# Altium schematic sheet RS485.SchDoc
size A3; DocumentNumber: 1; SheetNumber: 5; SheetTotal: 5; ModifiedBy: -; RevisionDate: -; Size: A3
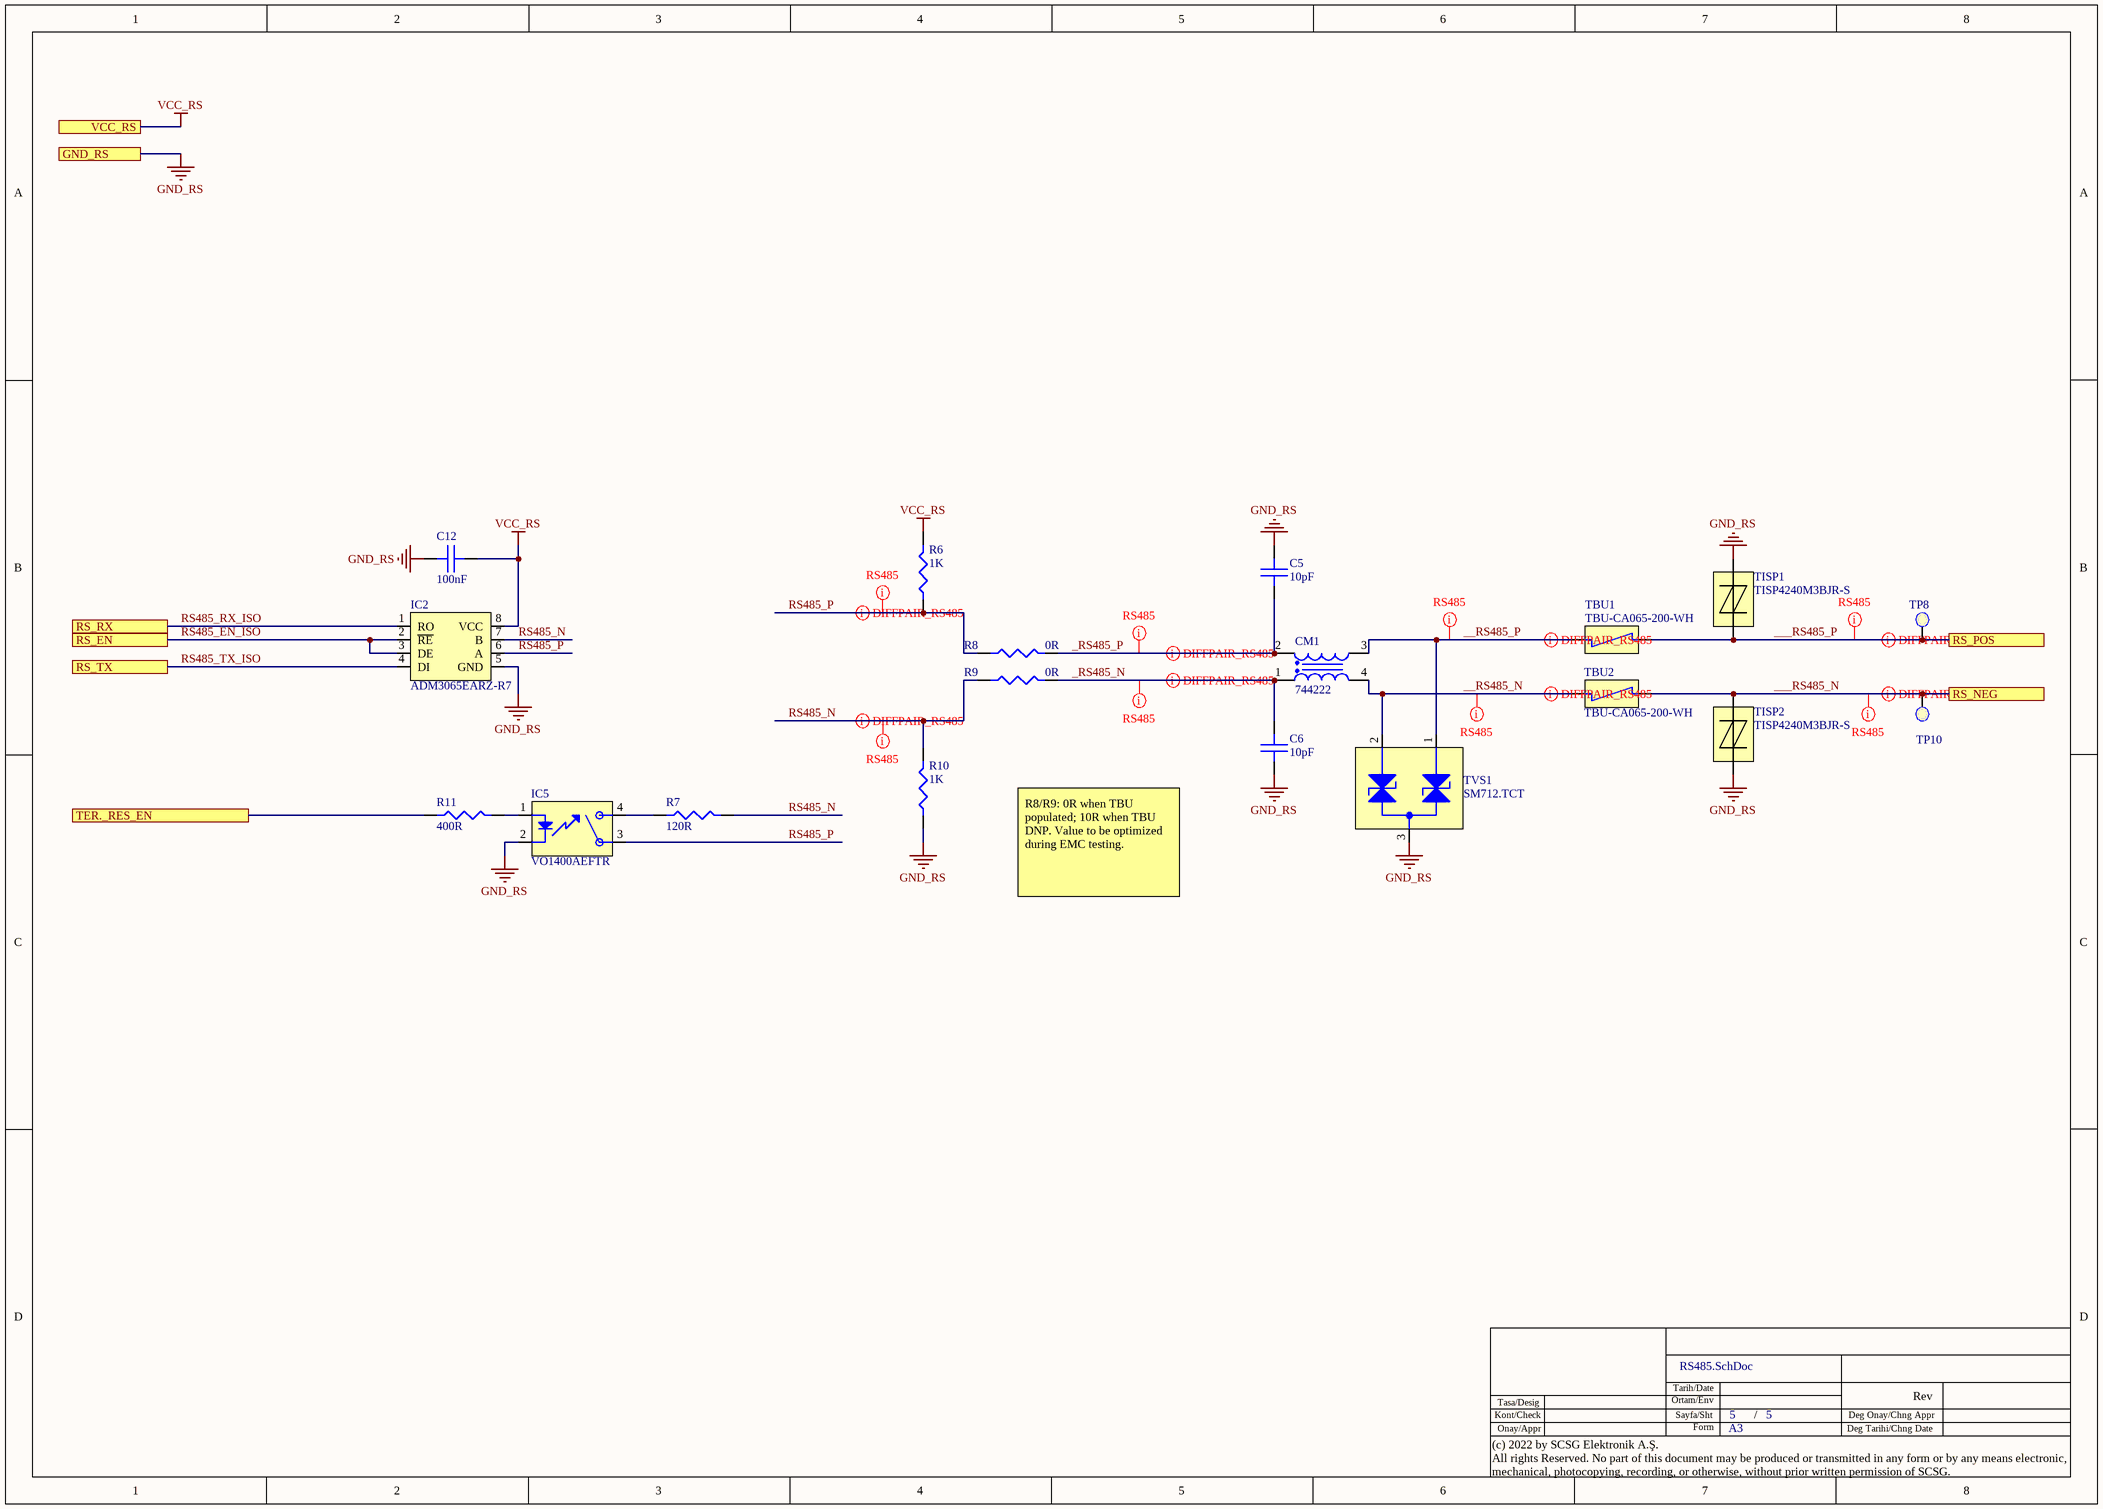
[diagram p0: RS485.SchDoc]

## Parts
C5  10pF  [C0402]
C6  10pF  [C0402]
C12  100nF  [C0603]
CM1  744222  [WE-SL2_74422]
IC2  ADM3065EARZ-R7  [SO08]
IC5  VO1400AEFTR  [SOP-4]
R6  1K  [R0805]
R7  120R  [R0805]
R8  0R  [R0603]
R9  0R  [R0603]
R10  1K  [R0805]
R11  400R  [R0603]
TBU1  TBU-CA065-200-WH  [TBU-CA065-200-WH]
TBU2  TBU-CA065-200-WH  [TBU-CA065-200-WH]
TISP1  TISP4240M3BJR-S  [SMB/DO-214AA]
TISP2  TISP4240M3BJR-S  [SMB/DO-214AA]
TP8  TestPoint1  [SMD_1mmPoint]  (value not drawn)  (no BOM)
TP10  TestPoint1  [SMD_1mmPoint]  (value not drawn)  (no BOM)
TVS1  SM712.TCT  [WE-TVS_SOT23-3L]

## Ports
GND_RS, RS_EN, RS_NEG, RS_POS, RS_RX, RS_TX, TER._RES_EN, VCC_RS

## Nets
GND_RS: C5.2 C6.1 C12.2 IC2.5(GND) IC5.2 R10.1 TISP1.1 TISP2.1 TVS1.3(GND) ; port GND_RS
VCC_RS: C12.1 IC2.8(VCC) R6.2 ; port VCC_RS
___RS485_N: TBU2.2 TISP2.2 TP10.1 ; port RS_NEG
___RS485_P: TBU1.2 TISP1.2 TP8.1 ; port RS_POS
__RS485_N: CM1.4 TBU2.1 TVS1.2(I/O_2)
__RS485_P: CM1.3 TBU1.1 TVS1.1(I/O_1)
_RS485_N: C6.2 CM1.1 R9.2
_RS485_P: C5.1 CM1.2 R8.2
RS485_EN_ISO: IC2.2(~{RE}) IC2.3(DE) ; port RS_EN
RS485_N: IC2.7(B) R7.2 R9.1 R10.2
RS485_P: IC2.6(A) IC5.3 R6.1 R8.1
RS485_RX_ISO: IC2.1(RO) ; port RS_RX
RS485_TX_ISO: IC2.4(DI) ; port RS_TX
TER._RES_EN: R11.1 ; port TER._RES_EN
NetIC5_1: IC5.1 R11.2
NetIC5_4: IC5.4 R7.1

## Layout directives
net class RS485: ___RS485_N, ___RS485_P, __RS485_N, __RS485_P, _RS485_N, _RS485_P, RS485_N, RS485_P
differential pair: ___RS485_N, ___RS485_P, __RS485_N, __RS485_P, _RS485_N, _RS485_P, RS485_N, RS485_P

## Notes on the sheet
- R8/R9: 0R when TBU populated; 10R when TBU DNP. Value to be optimized during EMC testing.
- Tarih/Date
- Kont/Check
- Tasa/Desig
- Onay/Appr
- Ortam/Env
- Sayfa/Sht
- Form
- A3
- /
- Deg Tarihi/Chng Date
- Deg Onay/Chng Appr
- Rev
- (c) 2022 by SCSG Elektronik A.Ş.
  All rights Reserved. No part of this document may be produced or transmitted in any form or by any means electronic, mechanical, photocopying, recording, or otherwise, without prior written permission of SCSG.

## Library data of the parts
C5 C6 = CC0402JRNPO9BN100: 10pF, 50V, NP0, 0402; Manufacturer: Yageo; Dielectric Material: Ceramic; Value: 10; Tolerance: 5%; Dielectric: C0G; Temperature Coefficient: 30ppm/°C; Purpose Of Usage: RS485; Working Voltage: 0; Supplier 1: Digi-Key; Manufacturer Part Number: CC0402JRNPO9BN100; RoHS: YES; Category: CAPASITOR; Case/Package: 0402; Case Code (Metric): 1005; Case Code (Imperial): 0402; Min Operating Temperature: -55°C; Max Operating Temperature: 125°C; Voltage Rating: 50V; Voltage Rating (DC): 50V; Height: 0.5mm; Supplier Part Number 1: 311-1014-2-ND; Mount: SMD; Stock ID: ??; Sub-Category: CERAMIC; Local Supplier: GENERAL; Price 10K: 0.00250
C12 = CC0603KRX7R8BB104: 100nF, 25V, X7R, 0603; Manufacturer: Yageo; Value: 100000; Tolerance: 10%; Dielectric Material: Ceramic; Purpose Of Usage: RS485; Working Voltage: 0; Supplier 1: Digi-Key; Supplier Part Number 1: 311-1341-1-ND; Manufacturer Part Number: CC0603KRX7R8BB104; RoHS: YES; Mount: SMD; Case/Package: 0603; Case Code (Imperial): 0603; Case Code (Metric): 1608; Min Operating Temperature: -55°C; Max Operating Temperature: 125°C; Voltage Rating: 25V; Voltage Rating (DC): 25V; Dielectric: X7R; Height: 0.8mm; Category: CAPASITOR; Sub-Category: CERAMIC; Stock ID: ??; Local Supplier: GENERAL; Price 10K: 0.00250
CM1 = 744222: Common Mode Chokes Dual 1000uH 6kOhm 100kHz 0.8A 0.207Ohm DCR SMD T/R Automotive AEC-Q200; Manufacturer: Wurth Elektronik; Current Rating: 800mA; DC Resistance (DCR): 310mΩ; Impedance: 6kΩ; Value: 1mH; Inductance Tolerance: 50%; Purpose Of Usage: RS485; Shielding: Shielded; Manufacturer Part Number: 744222; RoHS: YES; Category: INDUCTORS; Ambient Temperature Range High: 85°C; Ambient Temperature Range Low: -40°C; Case/Package: SMD/SMT; Height: 5mm; Length: 9.2mm; Max DC Current: 800mA; Max Operating Temperature: 125°C; Min Operating Temperature: -40°C; Test Frequency: 100kHz; Mount: SMD; Stock ID: ??; Sub-Category: COMMON MODE CHOKES; Supplier 1: Digi-Key; Supplier Part Number 1: 732-1485-1-ND
IC2 = ADM3065EARZ-R7: 3.0 V to 5.5 V, ±12 kV IEC ESD Protected, Half Duplex 50 Mbps RS-485 Transceiver; Manufacturer: Analog Devices; Max Supply Voltage: 5.5V; Min Supply Voltage: 3V; Purpose Of Usage: RS485; Manufacturer Part Number: ADM3065EARZ-R7; RoHS: YES; Category: INTEGRATED CIRCUITS; Max Operating Temperature: 85°C; Min Operating Temperature: -40°C; Case/Package: SOIC; Lead Free: Lead Free; Mount: SMD; MSL: 1; Stock ID: ??; Sub-Category: RS485 DRIVER; Supplier 1: Digi-Key; Supplier Part Number 1: 505-ADM3065EARZ-R7TR-ND
IC5 = VO1400AEFTR: 1 FORM A SOLID STATE RELAY Transistor Output SSR, 1-Channel, 3750V Isolation; Manufacturer: Vishay; Max Supply Voltage: 1.4V; Purpose Of Usage: RS485; Manufacturer Part Number: VO1400AEFTR; RoHS: YES; Category: INTEGRATED CIRCUITS; Case/Package: SOP; Lead Free: Lead Free; Max Operating Temperature: 85°C; Min Operating Temperature: -40°C; Mount: SMD; MSL: 1; Stock ID: ??; Sub-Category: SOLID STATE RELAY; Supplier 1: Digi-Key; Supplier Part Number 1: VO1400AEFTR-ND
R6 R10 = RC0805JR-071KL: 1K, %5, 1/8W, 0805; Manufacturer: YAGEO; Value: 1000; Tolerance: 5%; Power Rating: 125mW; Voltage Rating: 150V; Temperature Coefficient: 100ppm/°C; Purpose Of Usage: RS485; Supplier 1: Digi-Key; Supplier Part Number 1: 311-1.0KARCT-ND; Manufacturer Part Number: RC0805JR-071KL; RoHS: YES; Case/Package: 0805; Case Code (Imperial): 0805; Min Operating Temperature: -55°C; Max Operating Temperature: 155°C; Category: RESISTOR; Sub-Category: CHIP RESISTOR; Stock ID: ??; Mount: SMD; Max Power Dissipation: 125mW; Price 10K: 0.0025; Local Supplier: GENERAL
R7 = RC0805JR-07120RL: 120R, %5, 1/8W, 0805; Manufacturer: YAGEO; Value: 120; Power Rating: 125mW; Tolerance: 5%; Voltage Rating: 150V; Temperature Coefficient: 100ppm/°C; Purpose Of Usage: RS485; Supplier 1: Digi-Key; Supplier Part Number 1: 311-120ARCT-ND; Manufacturer Part Number: RC0805JR-07120RL; RoHS: YES; Case/Package: 0805; Case Code (Imperial): 0805; Min Operating Temperature: -55°C; Max Operating Temperature: 155°C; Max Power Dissipation: 125mW; Category: RESISTOR; Sub-Category: CHIP RESISTOR; Stock ID: ??; Mount: SMD; Price 10K: 0.0025; Local Supplier: GENERAL
R8 R9 = RC0603FR-070RL: 0R ,%1 ,1/10 W ,0603; Manufacturer: YAGEO; Value: 0; Power Rating: 100mW; Tolerance: 1%; Voltage Rating: 50V; Temperature Coefficient: 200ppm/°C; Working Voltage: 75V; Purpose Of Usage: RS485; Supplier 1: Digi-Key; Supplier Part Number 1: 311-0.0HRCT-ND; Manufacturer Part Number: RC0603FR-070RL; RoHS: YES; Case/Package: 0603; Case Code (Imperial): 0603; Min Operating Temperature: -55°C; Max Operating Temperature: 155°C; Max Power Dissipation: 100mW; Voltage Rating (DC): 50V; Category: RESISTOR; Supplier 2: JLCPCB; Supplier Part Number 2: C21189; Sub-Category: CHIP RESISTOR; Stock ID: ??; Mount: SMD; Price 10K: 0.0025; Local Supplier: GENERAL
R11 = PAT0603E4000BST1: 400R, %0.1, 1/8W, 0603; Manufacturer: Vishay Dale Thin Film; Max Power Dissipation: 150mW; Purpose Of Usage: RS485; Temperature Coefficient: 25ppm/°C; Tolerance: 0.1%; Value: 400; Manufacturer Part Number: PAT0603E4000BST1; RoHS: YES; Category: RESISTOR; Case/Package: 0603; Case Code (Imperial): 0603; Local Supplier: GENERAL; Max Operating Temperature: 155°C; Min Operating Temperature: -55°C; Mount: SMD; Power Rating: 150mW; Stock ID: ??; Sub-Category: CHIP RESISTOR; Supplier 1: Digi-Key; Supplier Part Number 1: PAT0603E4000BST1
TBU1 TBU2 = TBU-CA065-200-WH: A Single Bi-Directional, 650V, 200mA, 3-Pin DFN pkg TBU | Bourns TBU-CA065-200-WH; Direction: Bidirectional; ESD Protection: Yes; Max Junction Temperature (Tj): 125°C; Number of Circuits: 2; Number of Elements: 1; Peak Pulse Current: 400mA; Value: 8.6Ω; Voltage Rating: 300V; Purpose Of Usage: RS485; Manufacturer: Bourns; Manufacturer Part Number: TBU-CA065-200-WH; RoHS: YES; Category: PROTECTION; Case/Package: DFN; China RoHS: Compliant; Clamping Voltage: 650V; Current Rating: 200mA; Element Configuration: Single; Height: 1mm; Length: 6.5mm; Lifecycle Status: Production; Max Operating Temperature: 125°C; Manufacturer Package Identifier: TBU-CA065-200-WH; Min Operating Temperature: -55°C; Mounting Technology: Surface Mount; Pins: 12; Number of Terminals: 3; Voltage Rating (DC): 650V; Working Voltage: 300V; Local Supplier: GENERAL; Mount: SMD; Stock ID: ??; Sub-Category: TBU; Supplier 1: Digikey; Supplier Part Number 1: TBU-CA065-200-WHTR-ND
TISP1 TISP2 = TISP4240M3BJR-S: TVS Thyristor, Bidirectional, 2 Pins, DO-214AA (SMB), Overvoltage Protector, 240 V, 1 Circuit; Manufacturer: Bourns; Breakdown Voltage: 240V; Value: 50pF; Current Rating: 5A; Forward Voltage: 3V; Hold Current: 350mA; Max Junction Temperature (Tj): 150°C; Number of Circuits: 1; Peak Pulse Current: 220A; Purpose Of Usage: RS485; Manufacturer Part Number: TISP4240M3BJR-S; RoHS: YES; Category: PROTECTION; Case/Package: SMB; China RoHS: Non-Compliant; Export Control Classification Number (ECCN) Code: EAR99; Height: 2.4mm; Harmonized Tariff Schedule (HTS) Code: 8541.30.00.80; Introduction Date: 2005-05-05; Lifecycle Status: Production; Max Operating Temperature: 150°C; Min Operating Temperature: -40°C; Mounting Technology: Surface Mount; Number of Elements: 1; Pins: 2; Number of Terminals: 2; Local Supplier: GENERAL; Mount: SMD; Stock ID: ??; Sub-Category: TISP; Supplier 1: Digikey; Supplier Part Number 1: TISP4240M3BJR-S
TP8 TP10 = TestPoint1: test ölçüm noktası; Manufacturer: NO BOM DEVICE; Purpose Of Usage: RS485; Category: CONNECTORS; Sub-Category: TEST POINT; Manufacturer Part Number: NO BOM DEVICE; Stock ID: ??
TVS1 = SM712.TCT: SM Series 12 V 400 W Asymmetrical TVS Diode for Extended Common-Mode - SOT-23; Manufacturer: Semtech; Direction: Bidirectional; Number of Elements: 2; Min Breakdown Voltage: 7.5V; Clamping Voltage: 26V; Peak Pulse Power: 400W; Leakage Current: 1uA; Peak Pulse Current: 17A; Working Voltage: 12V; Max Breakdown Voltage: 13.3V; ESD Protection: Yes; Max Reverse Leakage Current: 20uA; Number of Channels: 2NUMBER; Purpose Of Usage: RS485; Manufacturer Part Number: SM712.TCT; RoHS: YES; Category: PROTECTION; Mounting Technology: Surface Mount; Case/Package: SOT-23; Pins: 3; Min Operating Temperature: -55°C; Max Operating Temperature: 125°C; Number of Bidirectional Channels: 2; Power Dissipation: 400W; Polarity: Bidirectional; Max Power Dissipation: 400W; Breakdown Voltage: 13.3V; Voltage Rating (DC): 12V; Clamping Voltage-Max: 12V; Length: 2.9mm; Lead Free: Lead Free; Local Supplier: GENERAL; Mount: SMD; Power Rating: 400W; Price 10K: 0.5; Stock ID: ??; Sub-Category: TVS - BI DIRECTIONAL; Supplier 1: Digikey; Supplier Part Number 1: SM712CT-ND